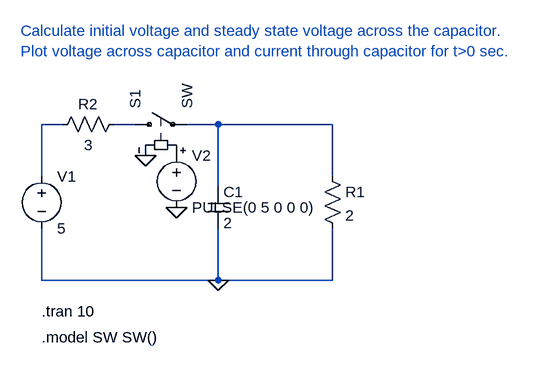
[diagram p0: schematic Lab4_ques3.asc]
Lab4_ques3.asc, the LTspice schematic file:
Version 4
SHEET 1 880 680
WIRE 80 160 48 160
WIRE 192 160 160 160
WIRE 320 160 272 160
WIRE 496 160 320 160
WIRE 48 240 48 160
WIRE 496 240 496 160
WIRE 320 256 320 160
WIRE 48 400 48 320
WIRE 320 400 320 320
WIRE 320 400 48 400
WIRE 496 400 496 320
WIRE 496 400 320 400
FLAG 208 208 0
FLAG 256 288 0
FLAG 320 400 0
SYMBOL Cap 304 256 R0
SYMATTR InstName C1
SYMATTR Value 2
SYMBOL Res 480 224 R0
SYMATTR InstName R1
SYMATTR Value 2
SYMBOL Res 176 144 R90
WINDOW 0 0 56 VBottom 2
WINDOW 3 32 56 VTop 2
SYMATTR InstName R2
SYMATTR Value 3
SYMBOL Voltage 48 224 R0
SYMATTR InstName V1
SYMATTR Value 5
SYMBOL sw 176 160 R270
SYMATTR InstName S1
SYMBOL Voltage 256 192 R0
SYMATTR InstName V2
SYMATTR Value PULSE(0 5 0 0 0)
TEXT 48 448 Left 2 !.tran 10
TEXT 48 488 Left 2 !.model SW SW()
TEXT 16 16 Left 2 ;Calculate initial voltage and steady state voltage across the capacitor.\nPlot voltage across capacitor and current through capacitor for t>0 sec.

The netlist it stands for:
* Lab4_ques3.asc
C1 N003 0 2
R1 N003 0 2
R2 N002 N001 3
V1 N001 0 5
S1 N002 N003 P001 0 SW
V2 P001 0 PULSE(0 5 0 0 0)
.tran 10
.model SW SW()
* Calculate initial voltage and steady state voltage across the capacitor.
* Plot voltage across capacitor and current through capacitor for t>0 sec.
.backanno
.end